# EAGLE design MICROCONTROLLER_ATMEGA-128L (EAGLE 9.6.2)
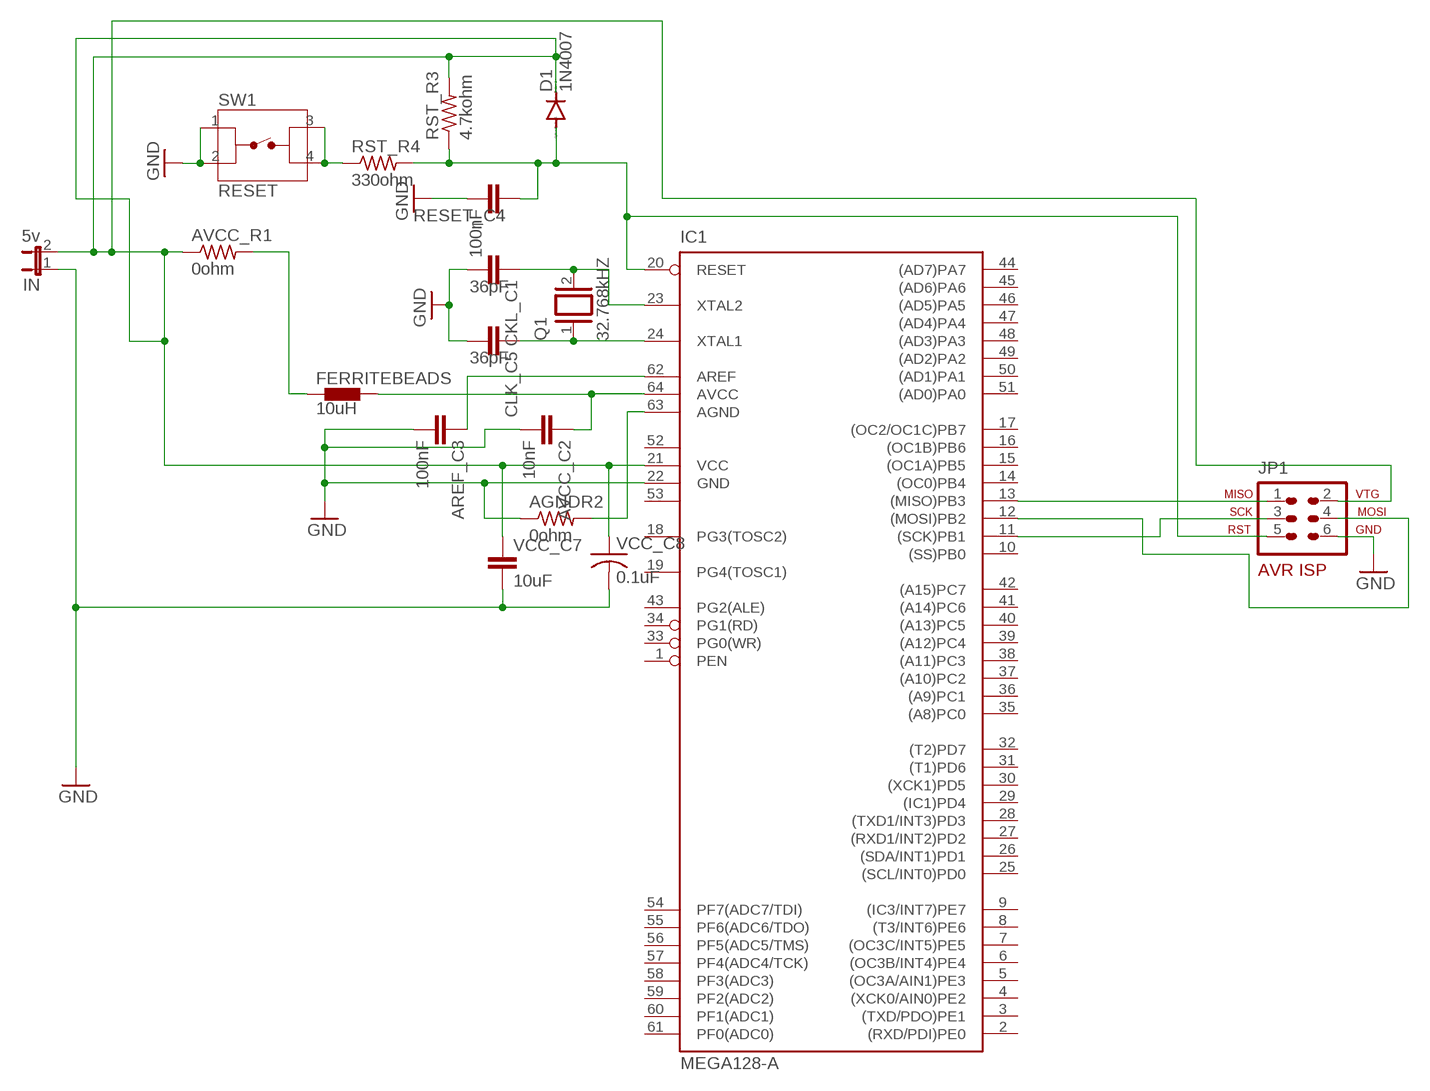
[diagram p0: schematic, sheet 1]

## Parts
AGNDR2  0ohm  R-US_0204/5  [0204/5]
AREF_C3  100nF  C5/3  [C5B3]
AVCC_C2  10nF  C5/3  [C5B3]
AVCC_R1  0ohm  R-US_0204/5  [0204/5]
CKL_C1  36pF  C5/3  [C5B3]
CLK_C5  36pF  C5/3  [C5B3]
D1  1N4007  1N4004  [DO41-10]
FERRITEBEADS  10uH  BLM15HB221SN1  [0402]
IC1  MEGA128-A  [TQFP64]
IN  5v  JP1E  [JP1]
JP1  AVR-ISP-6R  [AVR-ISP-6R]
Q1  32.768kHZ  XTAL/S  [QS]
RESET_C4  100nF  C5/3  [C5B3]
RST_R3  4.7kohm  R-US_0204/5  [0204/5]
RST_R4  330ohm  R-US_0204/5  [0204/5]
SW1  RESET  FSM4JSMA  [TE_FSM4JSMA]
VCC_C7  10uF  C5/3  [C5B3]
VCC_C8  0.1uF  C-USC0603K  [C0603K]

## Nets
GND: AGNDR2.1 AREF_C3.2 AVCC_C2.2 CKL_C1.2 CLK_C5.2 IC1.22(GND) IN.1 JP1.6 RESET_C4.2 SW1.1 SW1.2 VCC_C7.2 VCC_C8.2
N$1: RST_R4.1 SW1.3 SW1.4
N$2: AVCC_R1.2 FERRITEBEADS.1
N$3: AGNDR2.2 IC1.63(AGND)
N$4: AVCC_C2.1 FERRITEBEADS.2 IC1.64(AVCC)
N$5: AREF_C3.1 IC1.62(AREF)
N$7: D1.A IC1.20(RESET) JP1.5 RESET_C4.1 RST_R3.1 RST_R4.2
N$8: CKL_C1.1 IC1.23(XTAL2) Q1.2
N$9: IC1.13((MISO)PB3) JP1.1
N$10: CLK_C5.1 IC1.24(XTAL1) Q1.1
N$11: IC1.11((SCK)PB1) JP1.3
N$13: IC1.12((MOSI)PB2) JP1.4
N$14: AVCC_R1.1 D1.C IC1.21(VCC) IN.2 JP1.2 RST_R3.2 VCC_C7.1 VCC_C8.1
Unconnected: IC1.1(PEN) IC1.2((RXD/PDI)PE0) IC1.3((TXD/PDO)PE1) IC1.4((XCK0/AIN0)PE2) IC1.5((OC3A/AIN1)PE3) IC1.6((OC3B/INT4)PE4) IC1.7((OC3C/INT5)PE5) IC1.8((T3/INT6)PE6) IC1.9((IC3/INT7)PE7) IC1.10((SS)PB0) IC1.14((OC0)PB4) IC1.15((OC1A)PB5) IC1.16((OC1B)PB6) IC1.17((OC2/OC1C)PB7) IC1.18(PG3(TOSC2)) IC1.19(PG4(TOSC1)) IC1.25((SCL/INT0)PD0) IC1.26((SDA/INT1)PD1) IC1.27((RXD1/INT2)PD2) IC1.28((TXD1/INT3)PD3) IC1.29((IC1)PD4) IC1.30((XCK1)PD5) IC1.31((T1)PD6) IC1.32((T2)PD7) IC1.33(PG0(WR)) IC1.34(PG1(RD)) IC1.35((A8)PC0) IC1.36((A9)PC1) IC1.37((A10)PC2) IC1.38((A11)PC3) IC1.39((A12)PC4) IC1.40((A13)PC5) IC1.41((A14)PC6) IC1.42((A15)PC7) IC1.43(PG2(ALE)) IC1.44((AD7)PA7) IC1.45((AD6)PA6) IC1.46((AD5)PA5) IC1.47((AD4)PA4) IC1.48((AD3)PA3) IC1.49((AD2)PA2) IC1.50((AD1)PA1) IC1.51((AD0)PA0) IC1.54(PF7(ADC7/TDI)) IC1.55(PF6(ADC6/TDO)) IC1.56(PF5(ADC5/TMS)) IC1.57(PF4(ADC4/TCK)) IC1.58(PF3(ADC3)) IC1.59(PF2(ADC2)) IC1.60(PF1(ADC1)) IC1.61(PF0(ADC0))

## Power pins joined to a net without a drawn wire
GND1: IC1.53(GND1)
VCC1: IC1.52(VCC1)

## Library data of the parts
AGNDR2 AVCC_R1 RST_R3 RST_R4 = rcl:R-US_: RESISTOR, American symbol; SPICEPREFIX: R
AREF_C3 AVCC_C2 CKL_C1 CLK_C5 RESET_C4 VCC_C7 = capacitor-wima:C: CAPACITOR naming: grid - package width
D1 = diode:1N4004: DIODE general purpose rectifier, 1 A
FERRITEBEADS = inductors:BLM15H: EMIFIL (R) Chip Ferrite Bead for GHz Noise Source: http://www.murata.com/ Ferrite Bead BLM15H.pdf
IC1 = ASP_AVR[64pin]:MEGA128: MICROCONTROLLER 128 Kbytes FLASH 4 Kbytes SRAM 4 Kbytes EEPROM DUAL USART 8-channel 10 bit ADC Source: avr.lbr
IN = jumper:JP1E: JUMPER
JP1 = ASP_AVR[64pin]:AVR-ISP-6: AVR ISP-6 Serial Programming Header
Q1 = special:XTAL/S: CRYSTAL
SW1 = ASP_SWITCH:FSM4JSMA: Switch Tactile OFF (ON) SPST Round Button Gull Wing 0.05A 24VDC 2.6N SMD T/R Check prices <https://pricing.snapeda.com/search/part/FSM4JSMA/?ref=eda>; AVAILABILITY: Good; COMMENT: 4-1437565-1; CONFIGURATION_POLE-THROW: Single Pole - Single Throw; CONTACT_CURRENT_RATING: 50 mA; DESCRIPTION: Tactile Switch SPST-NO Top Actuated Surface Mount; EU_ROHS_COMPLIANCE: Compliant; MF: TE Connectivity; MP: FSM4JSMA; PACKAGE: None; PRICE: None; PURCHASE-URL: https://pricing.snapeda.com/search/part/FSM4JSMA/?ref=eda
VCC_C8 = rcl:C-US: CAPACITOR, American symbol; SPICEPREFIX: C

## Board
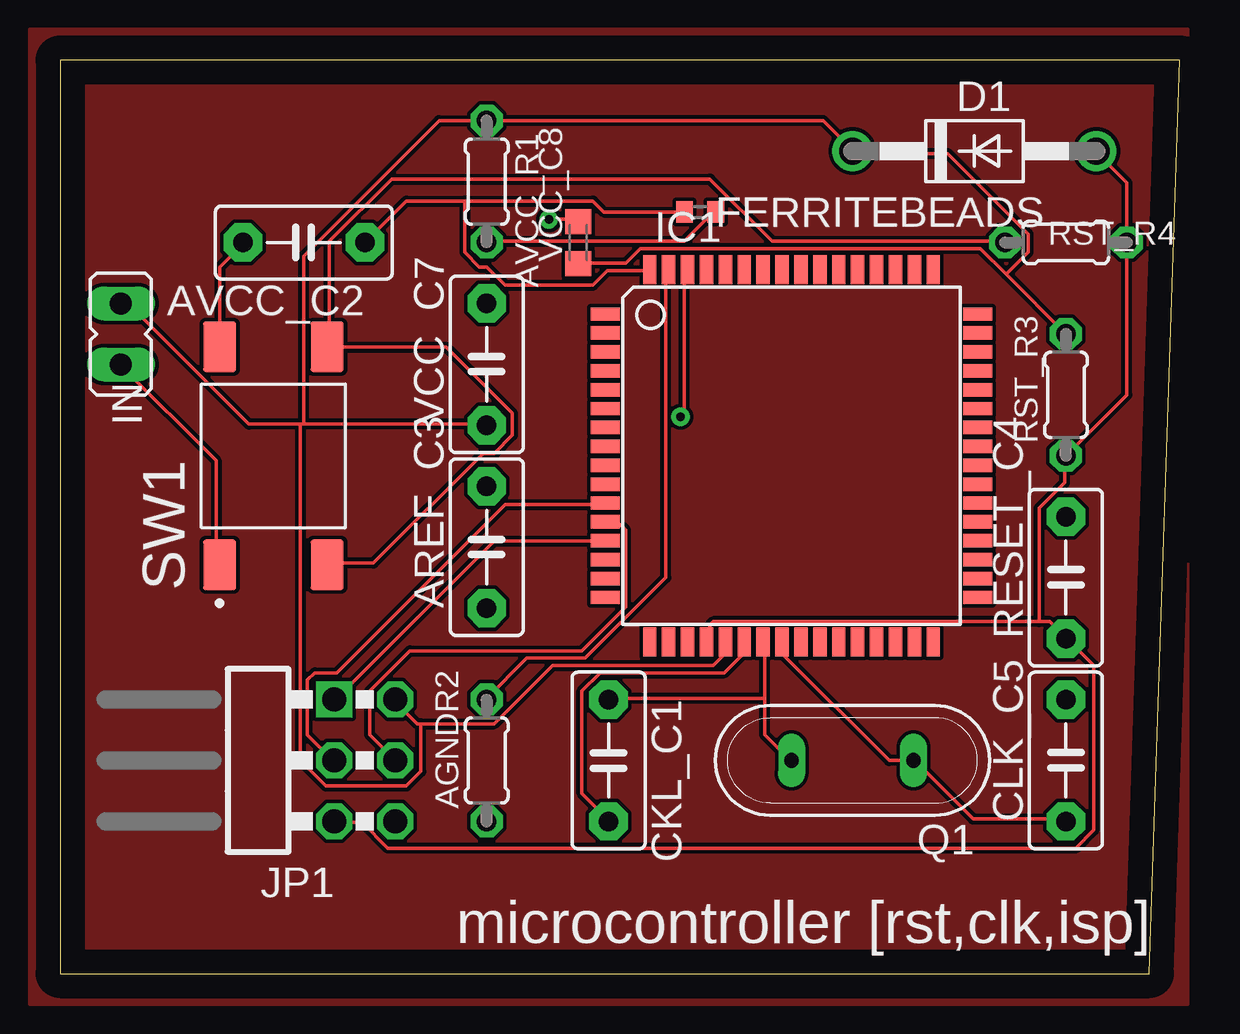
[diagram p1: board, top side]
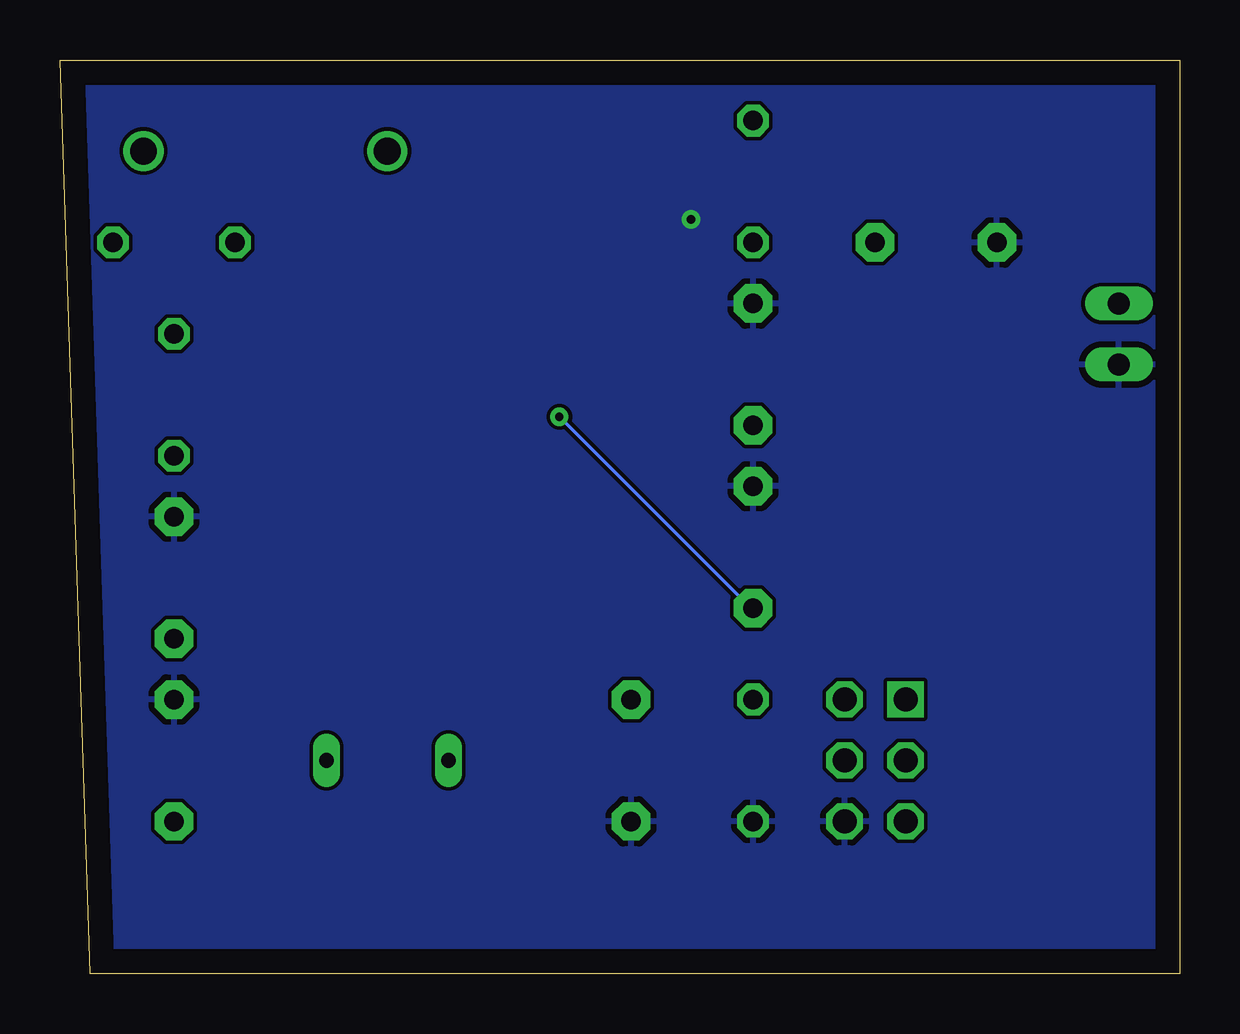
[diagram p2: board, bottom side, seen from below]

Size 46.66 x 38.09 mm. Coordinates in mm from the lower left corner, seen from the top.
Outline: 0,0 45.39,0 46.66,38.09 0,38.09 0,0
Copper layers (1*16): Top 0.035mm / dielectric 1.5mm / Bottom 0.035mm
Design rules "default": minimum track width 6mil, minimum drill 0.35mm, track to track 6mil, track to pad 6mil, pad to pad 6mil, via to via 6mil, smd to smd 6mil, copper to edge 40mil, drill to drill 6mil, minimum pad ring 10mil, minimum via ring 8mil, stop-mask expansion 4mil, vias tented up to drill 0mil, thermal gap 10mil

### Footprints (pad centres in the part's own frame; a part is rotated, then mirrored left to right if it is on the bottom)
0204/5 = drill 0.813 octagon: 1 -2.54,0; 2 2.54,0
C5B3 = drill 0.813 pad 1.6 octagon: 1 -2.54,0; 2 2.54,0
DO41-10 = drill 1.118: A 5.08,0; C -5.08,0
0402 = smd 0.7 x 0.9: 1 -0.65,0; 2 0.65,0
TQFP64 = smd 1.194 x 0.559: 1 -7.76,5.905; 2 -7.76,5.118; 3 -7.76,4.331; 4 -7.76,3.543; 5 -7.76,2.756; 6 -7.76,1.968; 7 -7.76,1.181; 8 -7.76,0.394; 9 -7.76,-0.394; 10 -7.76,-1.181; 11 -7.76,-1.968; 12 -7.76,-2.756; 13 -7.76,-3.543; 14 -7.76,-4.331; 15 -7.76,-5.118; 16 -7.76,-5.905; 33 7.76,-5.905; 34 7.76,-5.118; 35 7.76,-4.331; 36 7.76,-3.543; 37 7.76,-2.756; 38 7.76,-1.968; 39 7.76,-1.181; 40 7.76,-0.394; 41 7.76,0.394; 42 7.76,1.181; 43 7.76,1.968; 44 7.76,2.756; 45 7.76,3.543; 46 7.76,4.331; 47 7.76,5.118; 48 7.76,5.905 | smd 0.559 x 1.194: 17 -5.905,-7.76; 18 -5.118,-7.76; 19 -4.331,-7.76; 20 -3.543,-7.76; 21 -2.756,-7.76; 22 -1.968,-7.76; 23 -1.181,-7.76; 24 -0.394,-7.76; 25 0.394,-7.76; 26 1.181,-7.76; 27 1.968,-7.76; 28 2.756,-7.76; 29 3.543,-7.76; 30 4.331,-7.76; 31 5.118,-7.76; 32 5.905,-7.76; 49 5.905,7.76; 50 5.118,7.76; 51 4.331,7.76; 52 3.543,7.76; 53 2.756,7.76; 54 1.968,7.76; 55 1.181,7.76; 56 0.394,7.76; 57 -0.394,7.76; 58 -1.181,7.76; 59 -1.968,7.76; 60 -2.756,7.76; 61 -3.543,7.76; 62 -4.331,7.76; 63 -5.118,7.76; 64 -5.905,7.76
JP1 = drill 0.914 long: 1 0,-1.27; 2 0,1.27
AVR-ISP-6R = drill 1 square: 1 -2.54,-1.27 | drill 1 octagon: 2 -2.54,1.27; 3 0,-1.27; 4 0,1.27; 5 2.54,-1.27; 6 2.54,1.27
QS = drill 0.61 long: 1 -2.54,0; 2 2.54,0
TE_FSM4JSMA = smd 2.1 x 1.38: 1 -4.55,2.24; 2 4.55,2.24; 3 -4.55,-2.24; 4 4.55,-2.24
C0603K = smd 1.05 x 1.08: 1 -0.875,0; 2 0.875,0

### Placement (x,y rotation side)
AGNDR2  17.78,8.89 90 top
AREF_C3  17.78,17.78 90 top
AVCC_C2  10.16,30.48 180 top
AVCC_R1  17.78,33.02 270 top
CKL_C1  22.86,8.89 270 top
CLK_C5  41.91,8.89 90 top
D1  38.1,34.29 0 top
FERRITEBEADS  26.67,31.75 180 top
IC1  30.48,21.59 0 top
IN  2.54,26.67 0 top
JP1  12.7,8.89 270 top
Q1  33.02,8.89 180 top
RESET_C4  41.91,16.51 90 top
RST_R3  41.91,24.13 90 top
RST_R4  41.91,30.48 0 top
SW1  8.89,21.59 90 top
VCC_C7  17.78,25.4 90 top
VCC_C8  21.59,30.48 90 top

### Tracks (layer width: path | path; a pad name or v marks a point on that pad's centre or on a via)
GND  (via drill 0.35)
  Top 0.152: v20.37,31.45 21.59,31.45 VCC_C8.2 | IC1.22 28.45,13.77 28.45,13.31 27.69,12.55 22.5,12.55 21.74,11.79 21.74,7.52 22.81,6.45 CKL_C1.2 | SW1.1 6.5,17.12 6.5,21.39 2.54,25.35 IN.1 | SW1.2 6.66,26.26 6.66,29.46 7.57,30.38 AVCC_C2.2
  pour Bottom: -2.54,40.64 48.26,40.64 48.26,-1.27 48.26,-2.54 -2.54,-2.54
N$1
  Top 0.152: SW1.3 11.23,17.12 13.06,17.12 17.63,21.69 18.09,21.69 18.85,22.45 18.85,23.37 16.1,26.11 11.23,26.11 SW1.4 11.23,26.26 11.23,30.53 13.82,33.12 27.08,33.12 29.67,30.53 39.27,30.53 RST_R4.1
N$2
  Top 0.152: FERRITEBEADS.1 27.23,31.75 26.01,30.53 17.78,30.53 AVCC_R1.2
N$3
  Top 0.152: IC1.63 25.25,29.31 25.25,16.51 21.89,13.16 19.46,13.16 17.78,11.48 AGNDR2.2
N$4
  Top 0.152: FERRITEBEADS.2 22.66,31.75 22.2,32.21 16.87,32.21 | 16.87,32.21 14.43,32.21 AVCC_C2.1 | 16.87,32.21 16.87,30.07 17.48,29.46 17.78,29.46 18.54,28.7 22.2,28.7 22.81,29.31 24.49,29.31 IC1.64
N$5  (via drill 0.35)
  Top 0.152: v25.86,23.22 26.01,23.37 26.01,29.31 IC1.62
  Bottom 0.152: v25.86,23.22 17.78,15.14 AREF_C3.1
N$7
  Top 0.152: D1.A 43.23,34.19 44.45,32.97 RST_R4.2 44.45,24.13 RST_R3.1 41.86,21.54 41.86,20.47 40.79,19.41 40.79,14.68 | 40.79,14.68 41.25,14.68 41.86,14.07 RESET_C4.1 42.01,13.92 43.08,12.85 43.08,5.99 42.32,5.23 13.66,5.23 12.6,6.3 11.53,6.3 JP1.5 | 40.79,14.68 27.23,14.68 27.08,14.53 27.08,13.92 IC1.20
N$8
  Top 0.152: 29.36,11.48 29.36,9.96 30.43,8.89 Q1.2 | 29.36,11.48 29.36,13.77 IC1.23 | 29.36,11.48 22.96,11.48 CKL_C1.1
N$9
  Top 0.152: IC1.13 22.66,18.03 18.09,18.03 11.53,11.48 JP1.1
N$10
  Top 0.152: IC1.24 30.12,13.77 30.12,13.31 34.54,8.89 Q1.1 35.61,8.89 38.05,6.45 41.86,6.45 CLK_C5.1
N$11
  Top 0.152: IC1.11 22.66,19.56 18.54,19.56 11.53,12.55 10.62,12.55 10.31,12.24 10.31,9.96 11.38,8.89 JP1.3
N$13
  Top 0.152: JP1.4 12.9,9.96 12.9,11.79 14.58,13.46 21.74,13.46 23.57,15.29 23.57,18.49 23.27,18.8 22.81,18.8 IC1.12
N$14
  Top 0.152: RST_R3.2 39.42,29.16 | 39.42,29.16 38.35,30.23 24.18,30.23 23.57,29.62 VCC_C8.1 | 39.42,29.16 40.33,30.07 40.33,30.84 36.98,34.19 33.02,34.19 D1.C 33.02,34.34 31.8,35.56 AVCC_R1.1 15.8,35.56 10.16,29.92 10.16,22.91 | 15.04,10.41 14.88,10.41 13.97,11.33 JP1.2 | 15.04,10.41 18.09,10.41 20.52,12.85 27.23,12.85 27.69,13.31 27.69,13.77 IC1.21 | IN.2 2.85,27.94 7.87,22.91 10.01,22.91 | 10.16,22.91 17.78,22.91 VCC_C7.1 | 10.16,22.91 10.01,22.91 | 15.04,10.41 15.04,8.43 14.43,7.82 11.07,7.82 10.01,8.89 10.01,22.91
TOP
  pour Top: -1.27,39.37 46.99,39.37 46.99,0 46.99,-1.27 -1.27,-1.27

### Text on the board
tPlace: microcontroller [rst,clk,isp]